# EasyEDA schematic SCH_L298N电机驱动_2024-03-01.json
TITLE: L298N电机驱动; REV: 1.0; Date: 2024-02-27; Sheet: 1/1; Drawn By: congyu0721; Company: 工训A413+太原青禾之道
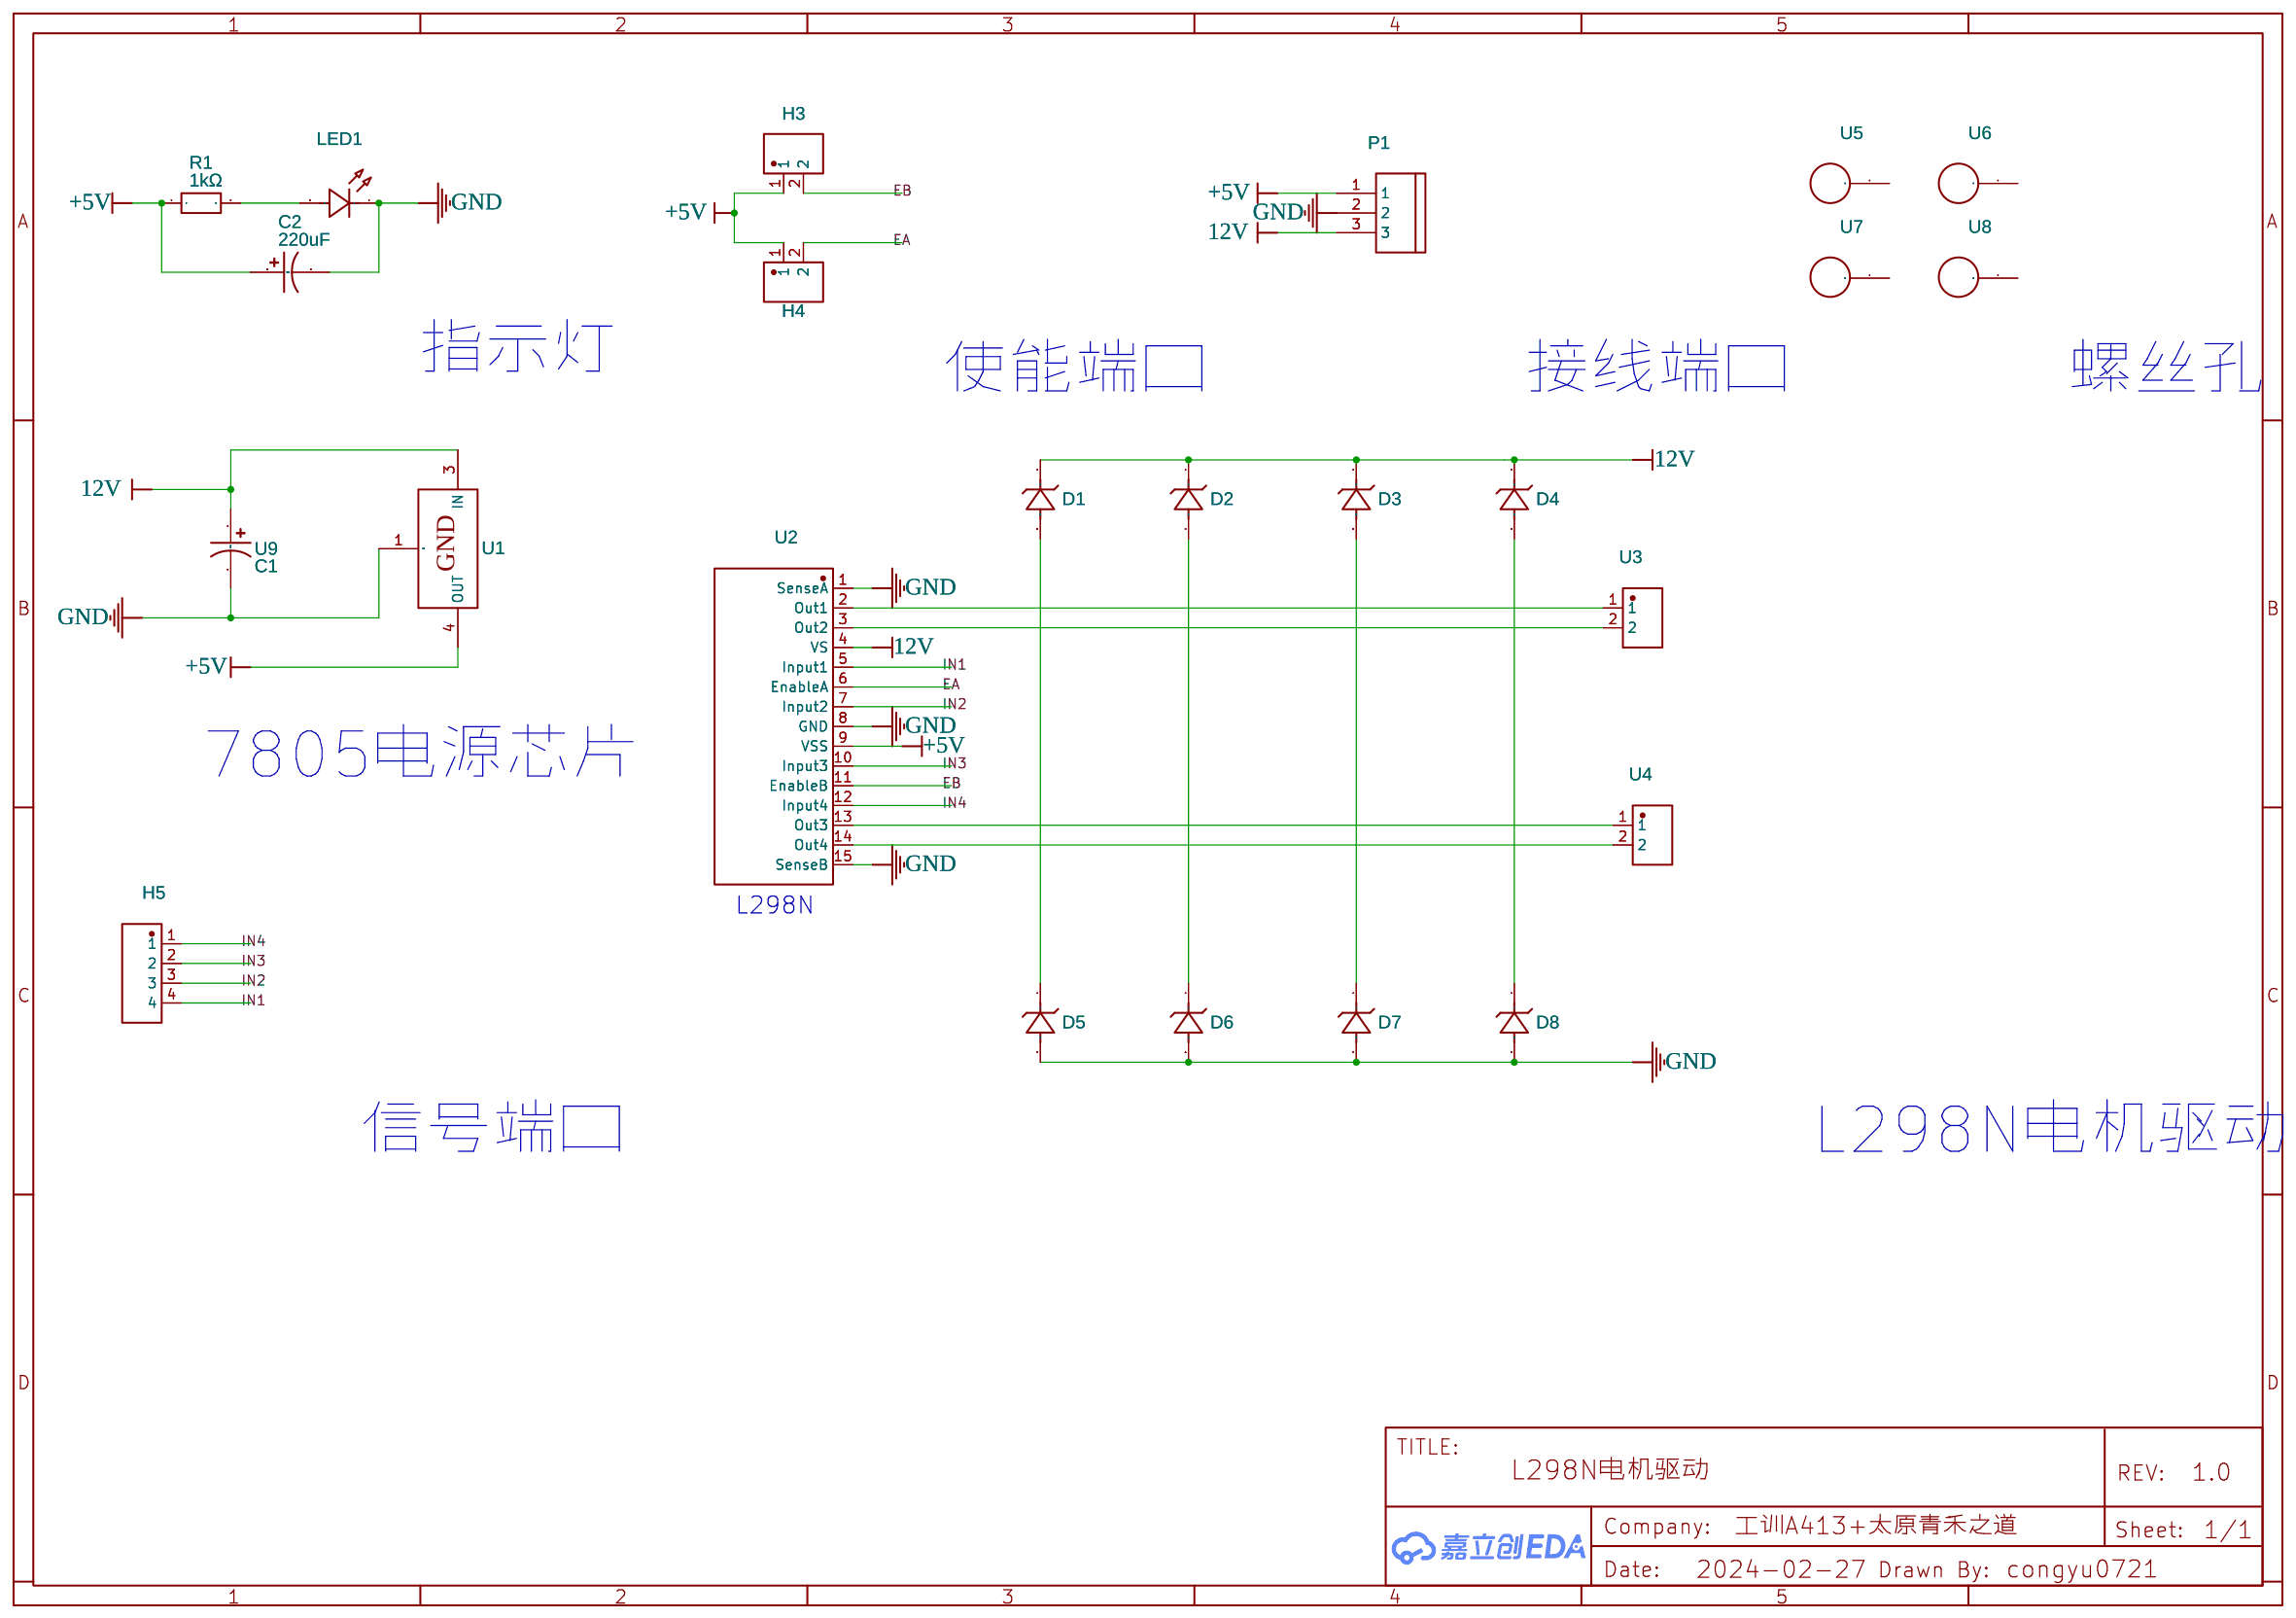
[diagram p0: schematic sheet]

## Parts
C2  220uF  [CAP-SMD_BD8.0-L8.3-W8.3-LS9.0-FD]
D1  SMF15A_C19077509  [SOD-123FL_L2.7-W1.8-LS3.8-RD]
D2  SMF15A_C19077509  [SOD-123FL_L2.7-W1.8-LS3.8-RD]
D3  SMF15A_C19077509  [SOD-123FL_L2.7-W1.8-LS3.8-RD]
D4  SMF15A_C19077509  [SOD-123FL_L2.7-W1.8-LS3.8-RD]
D5  SMF15A_C19077509  [SOD-123FL_L2.7-W1.8-LS3.8-RD]
D6  SMF15A_C19077509  [SOD-123FL_L2.7-W1.8-LS3.8-RD]
D7  SMF15A_C19077509  [SOD-123FL_L2.7-W1.8-LS3.8-RD]
D8  SMF15A_C19077509  [SOD-123FL_L2.7-W1.8-LS3.8-RD]
H3  DB302-5.0-2P-GN-S  [CONN-TH_DB302-5.0-2P]
H4  DB302-5.0-2P-GN-S  [CONN-TH_DB302-5.0-2P]
H5  826629-4  [HDR-TH_4P-P2.54-V-M-1]
LED1  RF-BGB170TS-CB-E0  [LED0805-RD_BLUE]
P1  WJ500V-5.08-3P-14-00A  [CONN-TH_3P-P5.00_WJ500V-5.08-3P]
R1  1kΩ  [R0805]
U1  LD1086DT33TR  [TO-252-2_L6.5-W6.1-P4.58-LS10.0-TL]
U2  L298N-HXY  [MULTIWATT-15_L19.6-W5.0-P1.27-L]
U3  DB302-5.0-2P-GN-S  [CONN-TH_DB302-5.0-2P]
U4  DB302-5.0-2P-GN-S  [CONN-TH_DB302-5.0-2P]
U5  铜柱M3*5+6  [SMD_BD4.2-L4.7-W4.7-D3.0]
U6  铜柱M3*5+6  [SMD_BD4.2-L4.7-W4.7-D3.0]
U7  铜柱M3*5+6  [SMD_BD4.2-L4.7-W4.7-D3.0]
U8  铜柱M3*5+6  [SMD_BD4.2-L4.7-W4.7-D3.0]
U9  C1  [CAP-SMD_BD8.0-L8.3-W8.3-LS9.0-FD]

## Library data of the parts
C2 U9 = HY1V221MC080105MEO: Contributor: lcsc; Supplier: LCSC; Supplier Part: C2977493; Manufacturer: HYNCDZ(宏远纳川); link: https://so.szlcsc.com/global.html?k=C2977493&ref=editor
D1-D8 = SMF15A_C19077509: Supplier: LCSC; Supplier Part: C19077509; Manufacturer: 宏迦橙; Manufacturer Part: SMF15A; Contributor: lcsc; link: https://so.szlcsc.com/global.html?k=C19077509&ref=editor
H3 H4 U3 U4 = DB302-5.0-2P-GN-S: Contributor: lcsc; Supplier: LCSC; Supplier Part: C2997275; Manufacturer: DORABO(地博电气); JLCPCB Part Class: Extended Part; link: https://so.szlcsc.com/global.html?k=C2997275&ref=editor
H5 = 826629-4: Contributor: LCSC; Supplier: LCSC; Supplier Part: C590277; Manufacturer: TE Connectivity(泰科电子); JLCPCB Part Class: Extended Part; link: https://so.szlcsc.com/global.html?k=C590277&ref=editor
LED1 = RF-BGB170TS-CB-E0: Contributor: LCSC; Supplier: LCSC; Supplier Part: C2908306; Manufacturer: Refond(瑞丰); JLCPCB Part Class: Extended Part; link: https://so.szlcsc.com/global.html?k=C2908306&ref=editor
P1 = WJ500V-5.08-3P-14-00A: Supplier: LCSC; Manufacturer: KANGNEX(康奈克斯电气); Manufacturer Part: WJ500V-5.08-3P; Supplier Part: C72334; JLCPCB Part Class: Extended Part; link: https://so.szlcsc.com/global.html?k=C72334&ref=editor
R1 = PTFR0805Q1K00P9: Contributor: LCSC; Supplier: LCSC; Supplier Part: C2692723; Manufacturer: RESI(开步睿思）; JLCPCB Part Class: Extended Part; link: https://so.szlcsc.com/global.html?k=C2692723&ref=editor
U1 = LD1086DT33TR: Supplier: LCSC; Manufacturer: ST(意法半导体); Supplier Part: C12051; JLCPCB Part Class: Extended Part; link: https://so.szlcsc.com/global.html?k=C12051&ref=editor
U2 = L298N-HXY: Contributor: lcsc; Supplier: LCSC; Supplier Part: C7427363; Manufacturer: HXY MOSFET(华轩阳电子); JLCPCB Part Class: Extended Part; link: https://so.szlcsc.com/global.html?k=C7427363&ref=editor
U5-U8 = 铜柱M3*5+6: Contributor: LCSC; Supplier: LCSC; Supplier Part: C87703; Manufacturer: 国产; JLCPCB Part Class: Extended Part; link: https://so.szlcsc.com/global.html?k=C87703&ref=editor

## Nets
12V: D1.1(K) D2.1(K) D3.1(K) D4.1(K) P1.3 U1.3(IN) U2.4(VS) U9.1
+5V: C2.1 H3.1 H4.1 P1.1 R1.1 U1.4(OUT) U2.9(VSS)
GND: C2.2 D5.2(A) D6.2(A) D7.2(A) D8.2(A) LED1.1(K) P1.2 U1.1(GND) U2.1(SenseA) U2.8(GND) U2.15(SenseB) U9.2
EA: H4.2 U2.6(EnableA)
EB: H3.2 U2.11(EnableB)
IN1: H5.4 U2.5(Input1)
IN2: H5.3 U2.7(Input2)
IN3: H5.2 U2.10(Input3)
IN4: H5.1 U2.12(Input4)
Net-(D1-2): D1.2(A) D5.1(K)
Net-(D2-2): D2.2(A) D6.1(K)
Net-(D3-2): D3.2(A) D7.1(K)
Net-(D4-2): D4.2(A) D8.1(K)
Net-(LED1-2): LED1.2(A) R1.2
Net-(U2-2): U2.2(Out1) U3.1
Net-(U2-3): U2.3(Out2) U3.2
Net-(U2-13): U2.13(Out3) U4.1
Net-(U2-14): U2.14(Out4) U4.2

Not connected (* = marked no-connect by the designer): U5 1; U6 1; U7 1; U8 1

## Notes on the sheet
- 指示灯
- 使能端口
- 接线端口
- 螺丝孔
- 7805电源芯片
- L298N
- 信号端口
- L298N电机驱动
